# EAGLE design Active crossover V12 SMD (EAGLE 9.6.2)
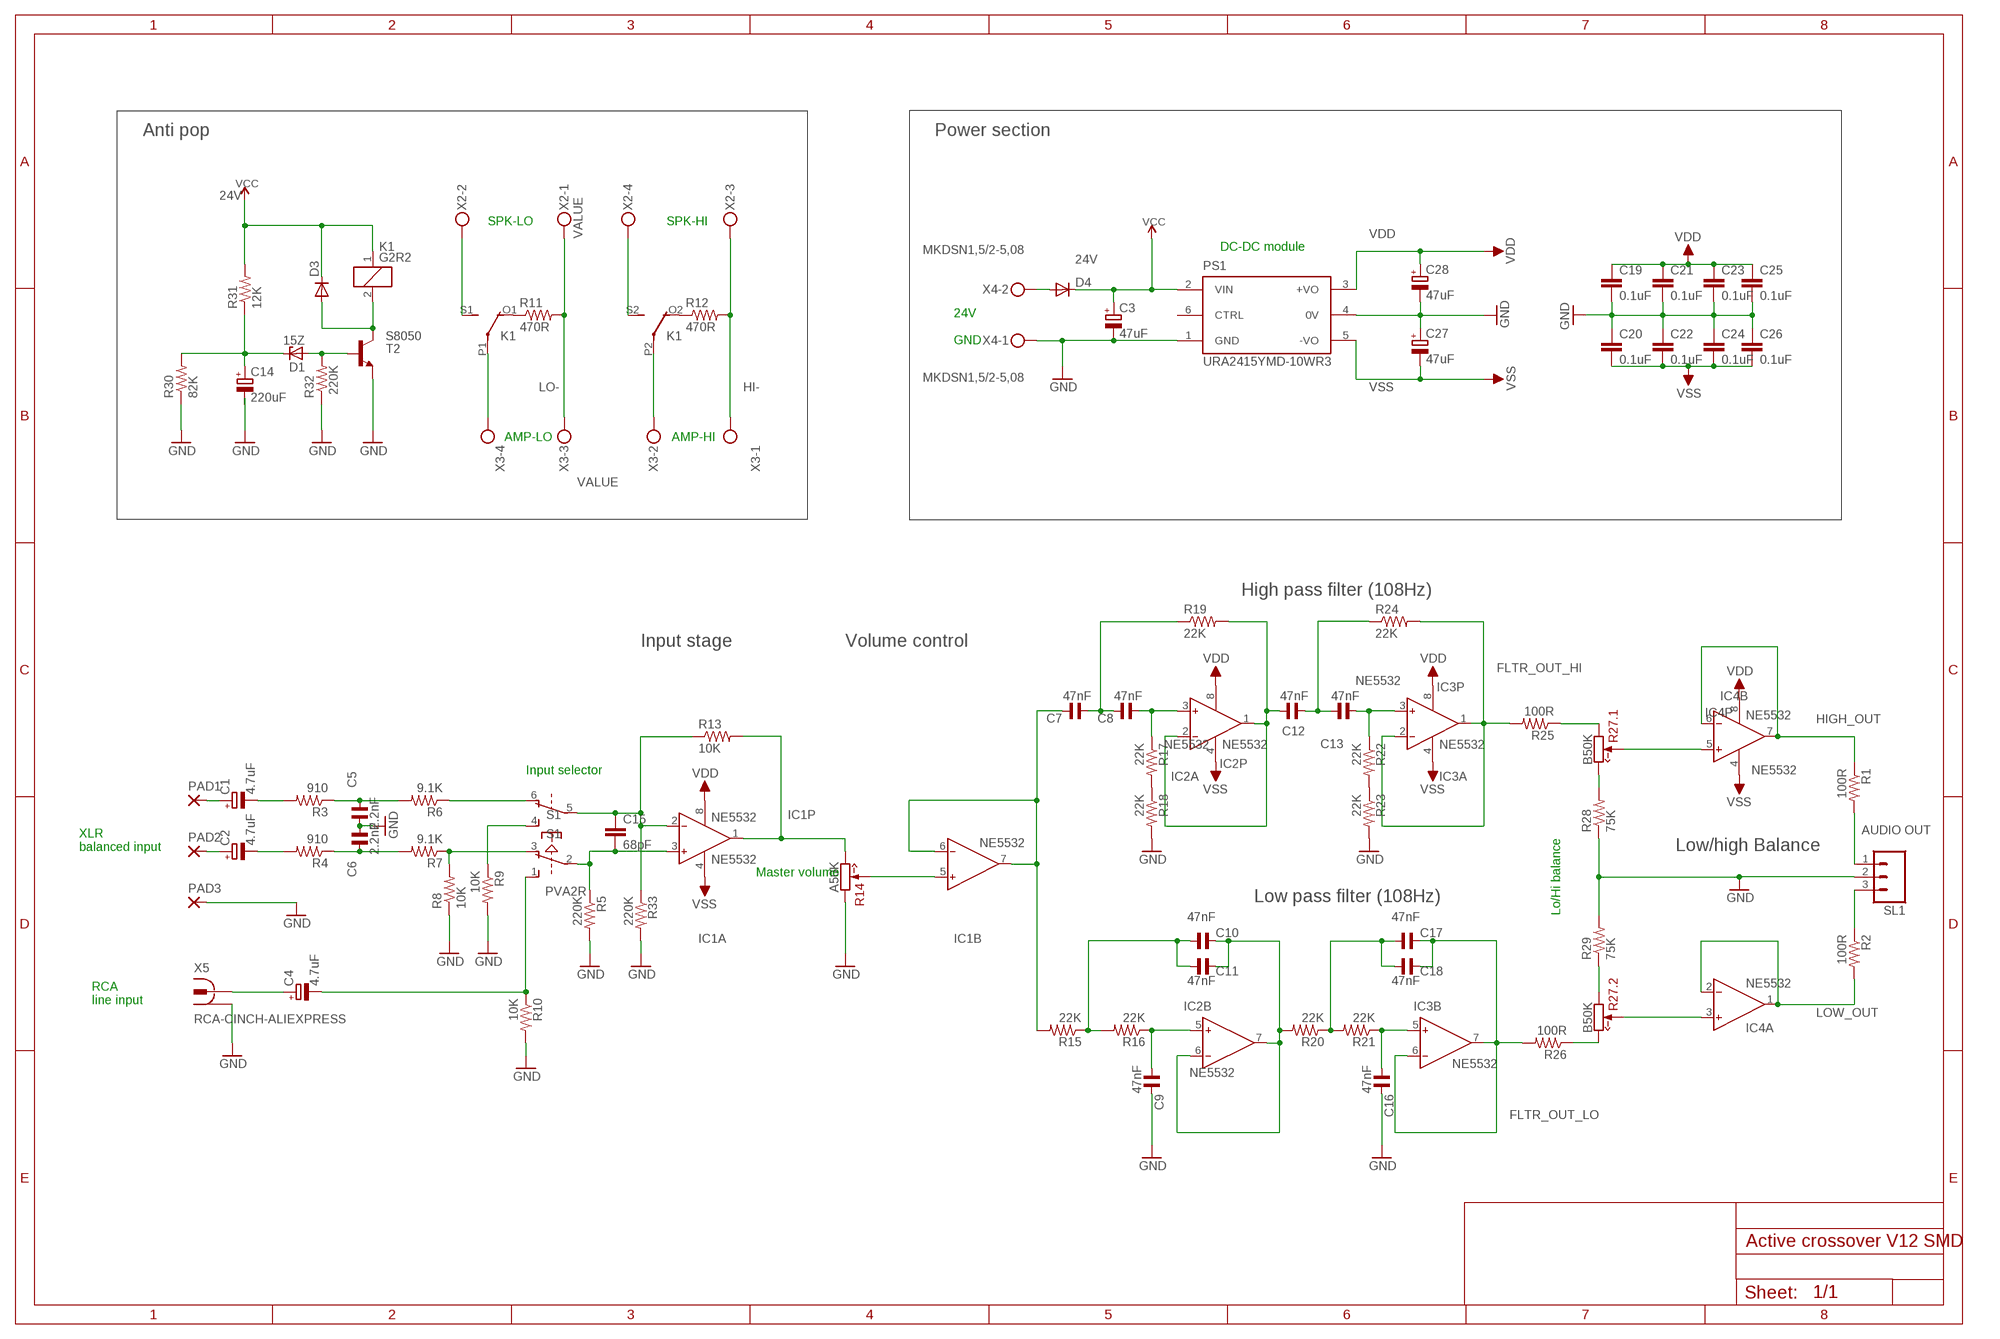
[diagram p0: schematic, sheet 1]

## Parts
C1  4.7uF  CPOL-EUE2-5  [E2-5]
C2  4.7uF  CPOL-EUE2-5  [E2-5]
C3  47uF  CPOL-EUE2.5-6  [E2,5-6]
C4  4.7uF  CPOL-EUE2-5  [E2-5]
C5  2.2nF  C_C050-025X072  [C050-025X072]
C6  2.2nF  C_C050-025X072  [C050-025X072]
C7  47nF  C_C050-025X072  [C050-025X072]
C8  47nF  C_C050-025X072  [C050-025X072]
C9  47nF  C_C050-025X072  [C050-025X072]
C10  47nF  C_C050-025X072  [C050-025X072]
C11  47nF  C_C050-025X072  [C050-025X072]
C12  47nF  C_C050-025X072  [C050-025X072]
C13  47nF  C_C050-025X072  [C050-025X072]
C14  220uF  CPOL-EUE3.5-8  [E3,5-8]
C15  68pF  0.1UF-25V-5%(0603)  [0603-CAP]
C16  47nF  C_C050-025X072  [C050-025X072]
C17  47nF  C_C050-025X072  [C050-025X072]
C18  47nF  C_C050-025X072  [C050-025X072]
C19  0.1uF  0.1UF-25V-5%(0603)  [0603-CAP]
C20  0.1uF  0.1UF-25V-5%(0603)  [0603-CAP]
C21  0.1uF  0.1UF-25V-5%(0603)  [0603-CAP]
C22  0.1uF  0.1UF-25V-5%(0603)  [0603-CAP]
C23  0.1uF  0.1UF-25V-5%(0603)  [0603-CAP]
C24  0.1uF  0.1UF-25V-5%(0603)  [0603-CAP]
C25  0.1uF  0.1UF-25V-5%(0603)  [0603-CAP]
C26  0.1uF  0.1UF-25V-5%(0603)  [0603-CAP]
C27  47uF  CPOL-EUE2.5-6  [E2,5-6]
C28  47uF  CPOL-EUE2.5-6  [E2,5-6]
D1  15Z  ZENER-DIODEZD-7.5  [ZDIO-7.5]
D3  DIODESMA-ALT  [SMA-DIODE_ALT]
D4  DIODESMB  [SMB-DIODE]
IC1  NE5532  AD712N  [DIL08]
IC2  NE5532  AD712N  [DIL08]
IC3  NE5532  AD712N  [DIL08]
IC4  NE5532  AD712N  [DIL08]
K1  G2R2  [G2R2]
PAD1  3,17/1,3  [3,17/1,3]
PAD2  3,17/1,3  [3,17/1,3]
PAD3  3,17/1,3  [3,17/1,3]
PS1  URA2415YMD-10WR3  URA2405YMD-10WR3  [CONV_URA2405YMD-10WR3]
R1  100R  R-US_0204/7  [0204/7]
R2  100R  R-US_0204/7  [0204/7]
R3  910  R-US_0204/7  [0204/7]
R4  910  R-US_0204/7  [0204/7]
R5  220K  R-US_0204/7  [0204/7]
R6  9.1K  R-US_0204/7  [0204/7]
R7  9.1K  R-US_0204/7  [0204/7]
R8  10K  R-US_0204/7  [0204/7]
R9  10K  R-US_0204/7  [0204/7]
R10  10K  R-US_0204/7  [0204/7]
R11  470R  R-US_0204/7  [0204/7]
R12  470R  R-US_0204/7  [0204/7]
R13  10K  R-US_0204/7  [0204/7]
R14  A50K  A10K(9MM)  [RV09-SINGLE]
R15  22K  R-US_0204/7  [0204/7]
R16  22K  R-US_0204/7  [0204/7]
R17  22K  R-US_0204/7  [0204/7]
R18  22K  R-US_0204/7  [0204/7]
R19  22K  R-US_0204/7  [0204/7]
R20  22K  R-US_0204/7  [0204/7]
R21  22K  R-US_0204/7  [0204/7]
R22  22K  R-US_0204/7  [0204/7]
R23  22K  R-US_0204/7  [0204/7]
R24  22K  R-US_0204/7  [0204/7]
R25  100R  R-US_0204/7  [0204/7]
R26  100R  R-US_0204/7  [0204/7]
R27  B50K  7PIN  [RK14-DUAL]
R28  75K  R-US_0204/7  [0204/7]
R29  75K  R-US_0204/7  [0204/7]
R30  82K  R-US_M0805  [M0805]
R31  12K  R-US_M0805  [M0805]
R32  220K  R-US_M0805  [M0805]
R33  220K  R-US_0204/7  [0204/7]
S1  PVA2R  [PVA2R]
SL1  AUDIO OUT  M03  [03P]
T2  S8050  BC846  [SOT23]
X2  MKDSN1,5/4-5,08  [MKDSN1,5/4-5,08]
X3  MKDSN1,5/4-5,08  [MKDSN1,5/4-5,08]
X4  MKDSN1,5/2-5,08  [MKDSN1,5/2-5,08]
X5  RCA-CINCH-ALIEXPRESS  [RCA-CINCH-ALIEXPRESS]

## Nets
24V: C3.+ D3.C D4.C K1.1 PS1.2(VIN) R31.2 ; supply symbol labelled VCC
FLTR_OUT_HI: IC3.1(A:OUT) IC3.2(A:IN-) R24.2 R25.2
FLTR_OUT_LO: C17.2 C18.2 IC3.6(B:IN-) IC3.7(B:OUT) R26.2
GND: C3.- C5.1 C6.2 C9.2 C14.- C16.2 C19.2 C20.1 C21.2 C22.1 C23.2 C24.1 C25.2 C26.1 C27.+ C28.- PAD3.1(P) PS1.1(GND) PS1.4(0V) R5.2 R8.1 R9.2 R10.2 R14.1(CCW) R18.2 R23.2 R28.1 R29.2 R30.1 R32.1 R33.2 SL1.2 T2.2(E) X4.1 X5.P$1 X5.P$3
HI-: R12.2 X2.3 X3.1
HIGH_OUT: IC4.6(B:IN-) IC4.7(B:OUT) R1.1
LO-: R11.2 X2.1 X3.3
LOW_OUT: IC4.1(A:OUT) IC4.2(A:IN-) R2.2
N$1: C1.+ PAD1.1(P)
N$2: C1.- R3.2
N$3: R7.1 R8.2 S1.3(1:O)
N$4: C15.1 IC1.2(A:IN-) R13.1 R33.1 S1.5(2:P)
N$5: C15.2 IC1.3(A:IN+) R5.1 S1.2(1:P)
N$6: C4.- R10.1 S1.1(1:S)
N$7: R6.1 S1.6(2:O)
N$8: R9.1 S1.4(2:S)
N$9: IC1.1(A:OUT) R13.2 R14.3(CW)
N$10: C14.+ D1.C R30.2 R31.1
N$11: K1.P1(2:P) X3.4
N$12: D1.A R32.2 T2.1(B)
N$13: D3.A K1.2 T2.3(C)
N$14: IC1.5(B:IN+) R14.2(W)
N$15: K1.S1(2:S) X2.2
N$16: C16.1 IC3.5(B:IN+) R21.1
N$17: C5.2 R3.1 R6.2
N$18: C6.1 R4.1 R7.2
N$19: C10.1 C11.1 R15.1 R16.2
N$20: C17.1 C18.1 R20.1 R21.2
N$21: C8.1 IC2.3(A:IN+) R17.1
N$22: C7.1 C8.2 R19.1
N$23: R27.3(.2:CCW) R29.1
N$24: C9.1 IC2.5(B:IN+) R16.1
N$25: R27.1'(.1:CW) R28.2
N$26: C12.2 IC2.1(A:OUT) IC2.2(A:IN-) R19.2
N$27: C12.1 C13.2 R24.1
N$28: C13.1 IC3.3(A:IN+) R22.1
N$29: C10.2 C11.2 IC2.6(B:IN-) IC2.7(B:OUT) R20.2
N$30: K1.O1(2:O) R11.1
N$31: K1.P2(3:P) X3.2
N$32: K1.S2(3:S) X2.4
N$33: K1.O2(3:O) R12.1
N$34: R17.2 R18.1
N$35: C7.2 IC1.6(B:IN-) IC1.7(B:OUT) R15.2
N$36: R22.2 R23.1
N$37: R25.1 R27.3'(.1:CCW)
N$38: IC4.5(B:IN+) R27.2'(.1:W)
N$39: IC4.3(A:IN+) R27.2(.2:W)
N$40: R26.1 R27.1(.2:CW)
N$42: C2.+ PAD2.1(P)
N$43: C2.- R4.2
N$44: C4.+ X5.P$2
N$45: D4.A X4.2
N$46: R1.2 SL1.1
N$47: R2.1 SL1.3
VDD: C19.1 C21.1 C23.1 C25.1 C28.+ IC1.8(P:V+) IC2.8(P:V+) IC3.8(P:V+) IC4.8(P:V+) PS1.3(+VO)
VSS: C20.2 C22.2 C24.2 C26.2 C27.- IC1.4(P:V-) IC2.4(P:V-) IC3.4(P:V-) IC4.4(P:V-) PS1.5(-VO)
Unconnected: PS1.6(CTRL)

## Notes on the sheet
- Anti pop | Power section
- SPK-LO | SPK-HI
- DC-DC module
- 24V
  
  GND
- AMP-LO | AMP-HI
- High pass filter (108Hz)
- Input stage | Volume control
- Input selector
- XLR 
  balanced input
- Low/high Balance
- Master volume
- Low pass filter (108Hz)
- Lo/Hi balance
- RCA 
  line input

## Library data of the parts
C1-C4 C14 C27 C28 = rcl:CPOL-EU: POLARIZED CAPACITOR, European symbol; SPICEPREFIX: C
C5-C13 C16-C18 = cap-wima:C_: NON-POLARIZED CAP
C15 = SparkFun-Capacitors:0.1UF-25V-5%(0603): CAP-08604; PROD_ID: CAP-08604; VALUE: 0.1uF
C19-C26 = SparkFun-Capacitors:0.1UF-25V-5%(0603): CAP-08604; PROD_ID: CAP-08604
D1 = diode:ZENER-DIODE: Z-Diode
D3 D4 = SparkFun-DiscreteSemi:DIODE: Diode These are standard reverse protection diodes and small signal diodes. SMA package can handle up to about 1A. SOD-323 can handle about 200mA. What the SOD-323 package when ordering, there are some mfgs out there that are 5-pin packages.
IC1-IC4 = analog-devices:AD712: Dual Precision, Low Cost, High Speed BiFET Op Amp Source: http://www.analog.com/static/imported-files/data_sheets/AD712.pdf; MF: ALTERA CORPORATION; MPN: AD712JNZ; OC_FARNELL: 9604898; OC_NEWARK: 59K4554
K1 = relay:G2R2: RELAY 2 x switch, Omron; MANUFACTURER: OMRON COMPONENTS USA; MPN: G2R-2-DC6
PAD1-PAD3 = wirepad:3,17/1,3: THROUGH-HOLE PAD
PS1 = URA2405YMD-10WR3:URA2405YMD-10WR3: DC/DC Converter; MANUFACTURER: Mornsun; MAXIMUM_PACKAGE_HEIGHT: 12.20 mm; PARTREV: 2019.11.13-A/9; STANDARD: Manufacturer Recommendations
R1-R13 R15-R26 R28-R33 = adafruit:R-US_: RESISTOR, American symbol
R14 = potentiometers:?; MOUSER: 652-PTV09A4025FA103
R27 = potentiometers:7PIN
S1 = switch-misc:PVA2R: ITT SWITCH
SL1 = con-amp-quick:M03: AMP QUICK CONNECTOR; OC_FARNELL: unknown; OC_NEWARK: unknown
T2 = transistor:BC846: NPN TRANSISTOR
X2 X3 = con-phoenix-508:MKDSN1,5/4-5,08: MKDSN 1,5/ 4-5,08 Printklemme Nennstrom: 13,5 A Nennspannung: 250 V Rastermaß: 5,08 mm Polzahl: 4 Anschlussart: Schraubanschluss Montage: Löten Anschlussrichtung Leiter/Platine: 0 ° Artikelnummer: 1729144 Source: http://eshop.phoenixcontact.com .. 1729144.pdf
X4 = con-phoenix-508:MKDSN1,5/2-5,08: MKDSN 1,5/ 2-5,08 Printklemme Nennstrom: 13,5 A Nennspannung: 250 V Rastermaß: 5,08 mm Polzahl: 2 Anschlussart: Schraubanschluss Montage: Löten Anschlussrichtung Leiter/Platine: 0 ° Artikelnummer: 1729128 Source: http://eshop.phoenixcontact.com .. 1729128.pdf
X5 = con-conrad:RCA-CINCH-ALIEXPRESS: Cinch Connector ( RCA Jack ) Cinch-Einbaukupplung 90º 72345 Vernickelt BKL Electronic Source: Conrad <http://www.conrad.de/ce/de/product/736880>

## Board
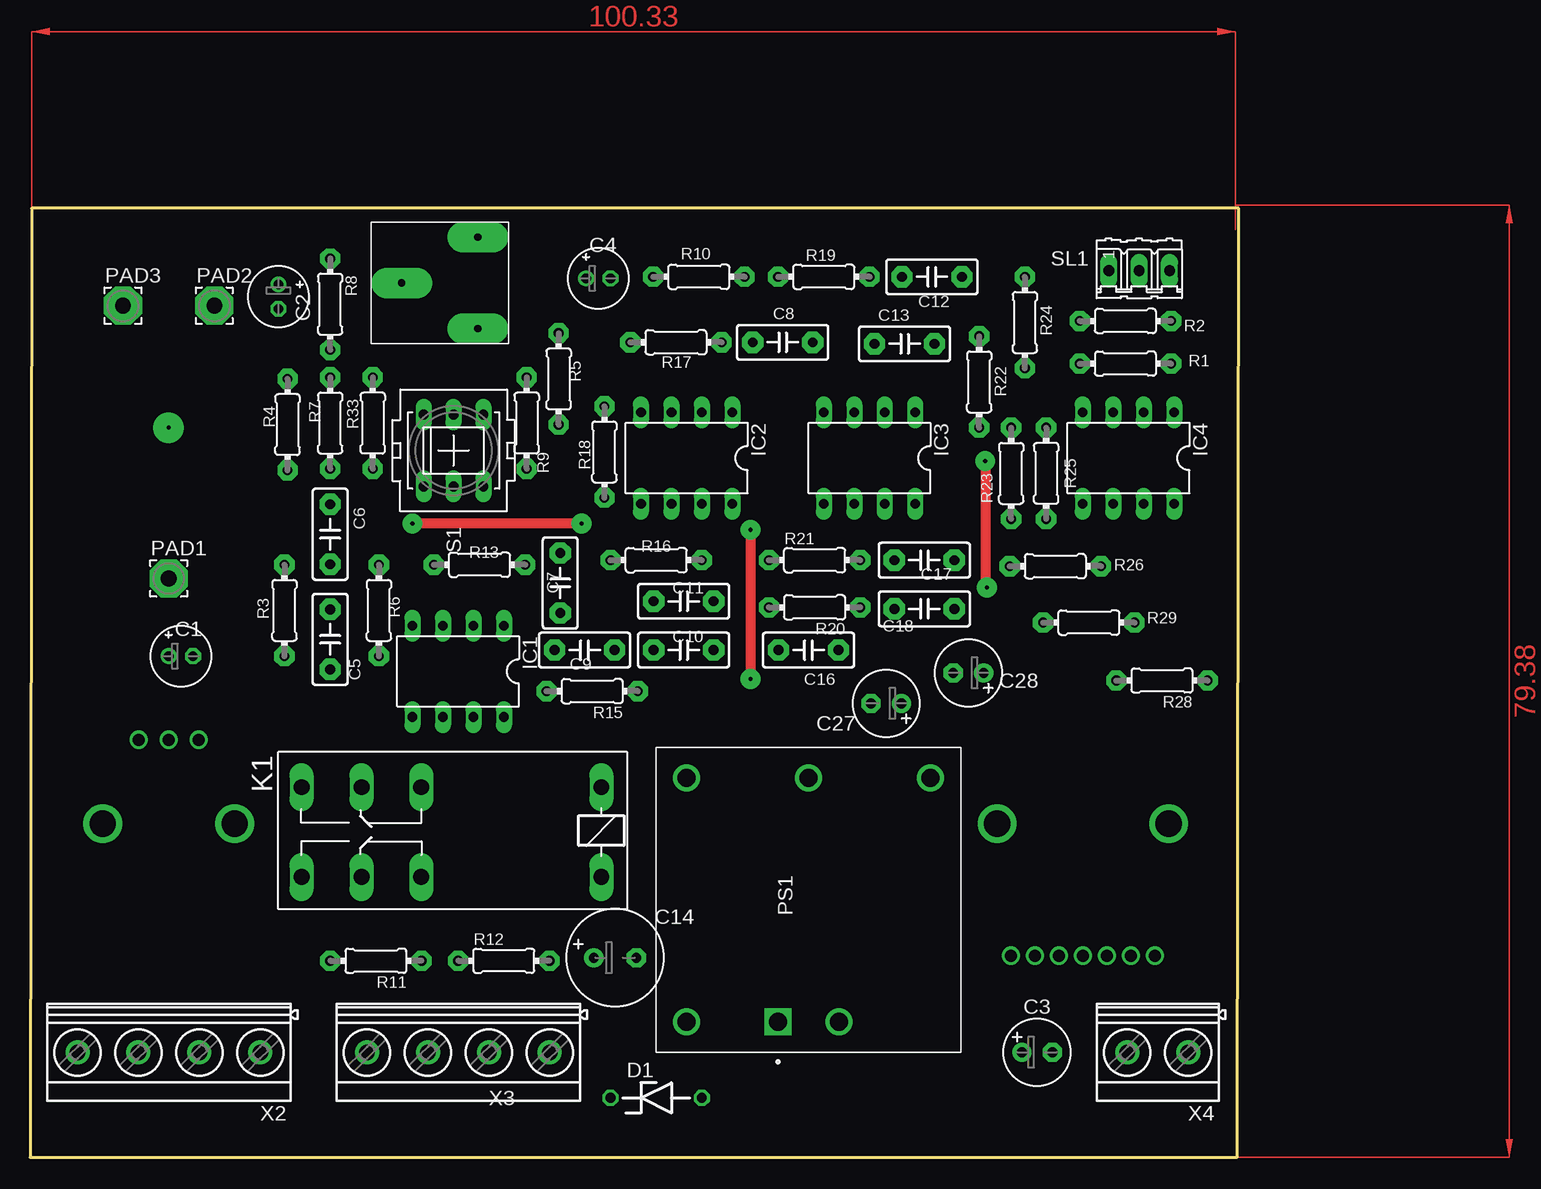
[diagram p1: board, top side]
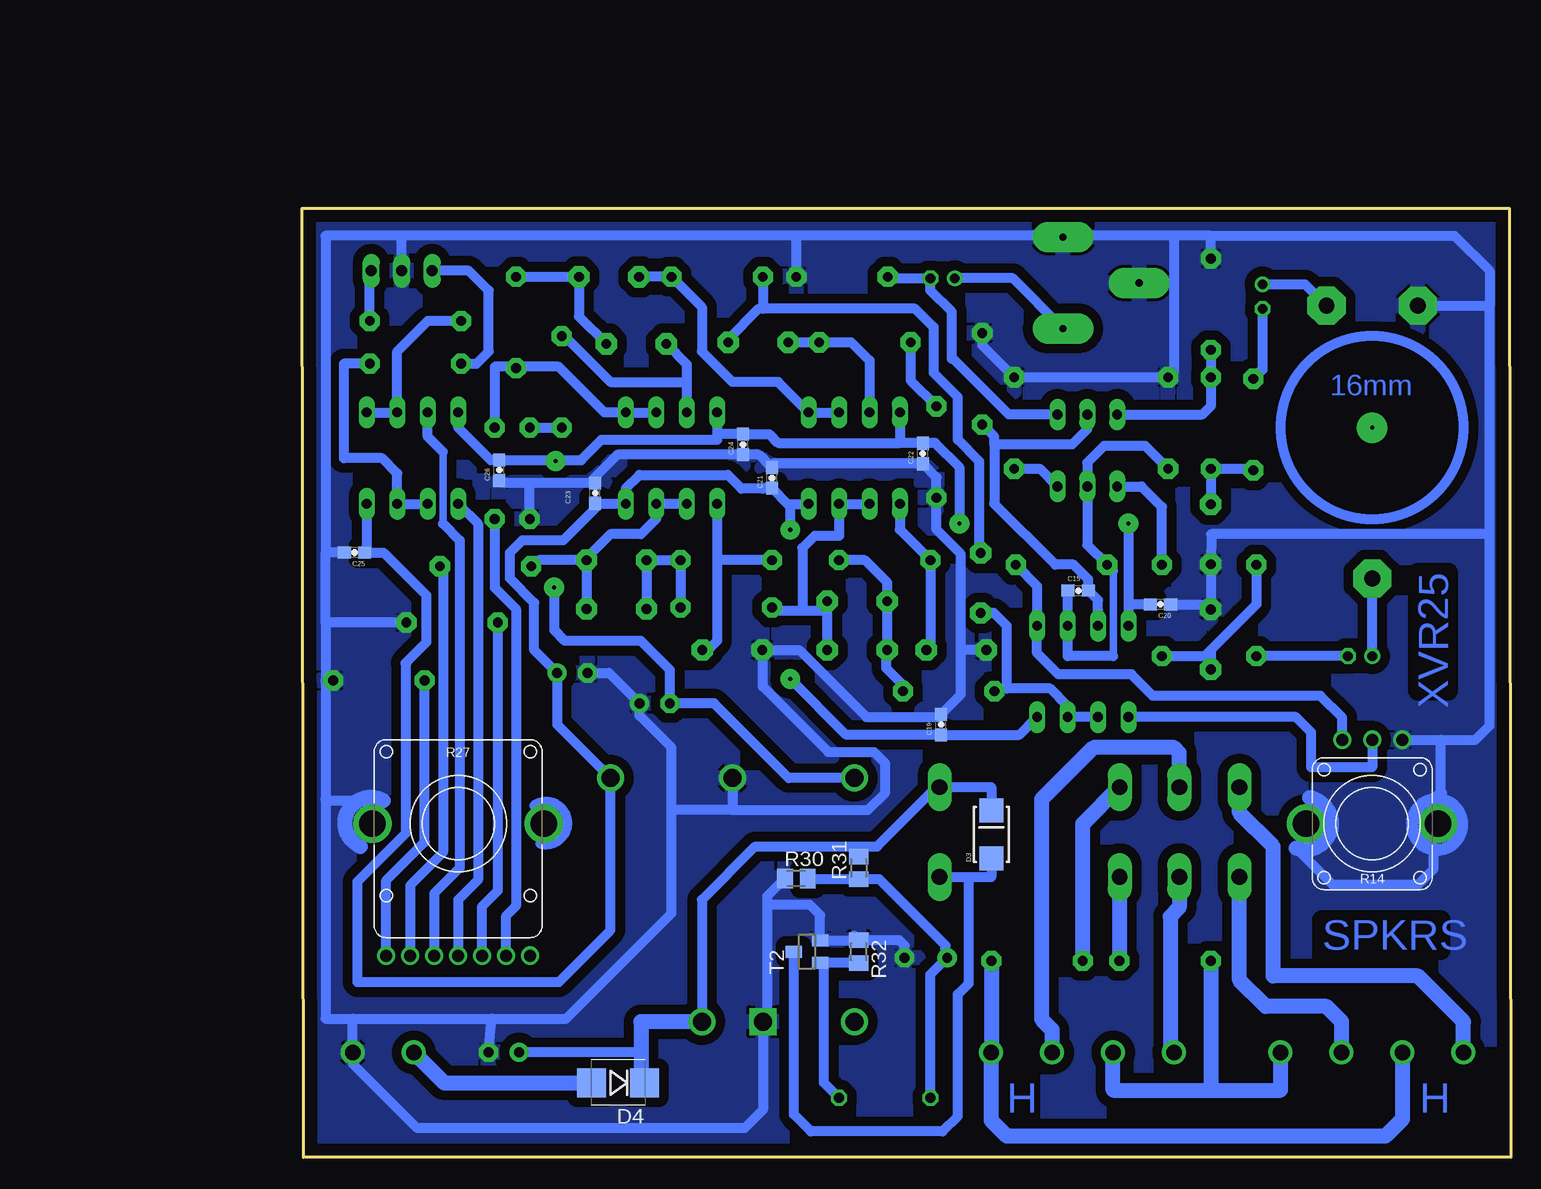
[diagram p2: board, bottom side, seen from below]

Size 100.76 x 79.11 mm. Coordinates in mm from the lower left corner, seen from the top.
Outline: 0,0 100.63,0 100.76,79.11 0.13,79.11 0,0
Copper layers (1*16): Top 0.035mm / dielectric 1.5mm / Bottom 0.035mm
Design rules "default": minimum track width 6mil, minimum drill 0.35mm, track to track 6mil, track to pad 6mil, pad to pad 6mil, via to via 6mil, smd to smd 6mil, copper to edge 40mil, drill to drill 6mil, minimum pad ring 10mil, minimum via ring 8mil, stop-mask expansion 4mil, vias tented up to drill 0mil, thermal gap 10mil

### Footprints (pad centres in the part's own frame; a part is rotated, then mirrored left to right if it is on the bottom)
E2-5 = drill 0.813 pad 1.27: + -1.016,0 | drill 0.813 pad 1.27 octagon: - 1.016,0
E2,5-6 = drill 0.813 pad 1.6: + -1.27,0 | drill 0.813 pad 1.6 octagon: - 1.27,0
C050-025X072 = drill 0.813 pad 1.778 octagon: 1 -2.5,0; 2 2.5,0
E3,5-8 = drill 0.813 pad 1.6: + -1.778,0 | drill 0.813 pad 1.6 octagon: - 1.778,0
0603-CAP = smd 1.1 x 1: 1 -0.85,0; 2 0.85,0
ZDIO-7.5 = drill 0.813 octagon: A 3.81,0; C -3.81,0
SMA-DIODE_ALT = smd 2 x 2: A -2,0; C 2,0
SMB-DIODE = smd 2.4 x 2.4: A 2.2,0; C -2.2,0
DIL08 = drill 0.813 long: 1 -3.81,-3.81; 2 -1.27,-3.81; 3 1.27,-3.81; 4 3.81,-3.81; 5 3.81,3.81; 6 1.27,3.81; 7 -1.27,3.81; 8 -3.81,3.81
G2R2 = drill 1.321 long: 1 -2.54,-3.683; 2 -2.54,3.81; O1 12.471,3.81; O2 12.471,-3.683; P1 17.45,3.81; P2 17.45,-3.683; S1 22.454,3.81; S2 22.454,-3.683
3,17/1,3 = drill 1.321 pad 3.175 octagon: 1 0,0
CONV_URA2405YMD-10WR3 = drill 1.5 square: 1 -10.16,2.54 | drill 1.5: 2 -10.16,-2.54; 3 10.16,-10.16; 4 10.16,0; 5 10.16,10.16; 6 -10.16,10.16
0204/7 = drill 0.813 pad 1.676 octagon: 1 -3.81,0; 2 3.81,0
RV09-SINGLE = drill 1: 1 -2.5,-7; 2 0,-7; 3 2.5,-7 | drill 2.2: S1 -5.5,0; S2 5.5,0
RK14-DUAL = drill 1: 1 -4,-11; 1' -6,-11; 2 -2,-11; 2' 0,-11; 3 2,-11; 3' 4,-11; 4 6,-11 | drill 2.2: S1 -7.15,0; S2 7.15,0
M0805 = smd 1.3 x 1.6: 1 -0.95,0; 2 0.95,0
PVA2R = drill 0.813 long: 1 -2.997,2.489; 2 -2.997,0; 3 -2.997,-2.489; 4 2.997,2.489; 5 2.997,0; 6 2.997,-2.489
03P = drill 0.914 long: 1 -2.54,0; 2 0,0; 3 2.54,0
SOT23 = smd 1 x 1.4: 1 -0.95,-1.1; 2 0.95,-1.1; 3 0,1.1
MKDSN1,5/4-5,08 = drill 1.3 pad 2: 1 -7.641,0.025; 2 -2.561,0.025; 3 2.519,0.025; 4 7.599,0.025
MKDSN1,5/2-5,08 = drill 1.3 pad 2: 1 -2.561,0.025; 2 2.519,0.025
RCA-CINCH-ALIEXPRESS = drill 0.6 pad 2.54 long: P$1 -3.81,0; P$2 3.81,0; P$3 0,-6.35

### Placement (x,y rotation side)
C1  12.57,41.78 0 top
C2  20.7,71.76 270 top
C3  83.95,8.76 0 top
C4  47.37,73.28 0 top
C5  25.02,43.18 270 top
C6  25.02,51.94 270 top
C7  44.2,47.88 270 top
C8  62.74,67.95 0 top
C9  46.23,42.29 180 top
C10  54.48,42.29 0 top
C11  54.48,46.35 0 top
C12  75.18,73.41 180 top
C13  72.9,67.82 0 top
C14  48.77,16.64 0 top
C15  36.07,47.24 0 bottom
C16  64.9,42.29 180 top
C17  74.55,49.78 0 top
C18  74.55,45.72 0 top
C19  47.5,36.07 90 bottom
C20  29.21,46.1 180 bottom
C21  61.6,56.64 90 bottom
C22  49.02,58.67 90 bottom
C23  76.33,55.37 90 bottom
C24  64.01,59.44 90 bottom
C25  96.39,50.42 180 bottom
C26  84.33,57.28 90 bottom
C27  71.37,37.85 180 top
C28  78.23,40.39 180 top
D1  52.2,4.95 0 top
D3  43.31,26.92 90 bottom
D4  74.42,6.22 180 bottom
IC1  35.69,40.51 180 top
IC2  54.74,58.29 180 top
IC3  69.98,58.29 180 top
IC4  91.57,58.29 180 top
K1  45.09,27.18 180 top
PAD1  11.56,48.26 0 top
PAD2  15.37,70.99 0 top
PAD3  7.75,70.99 0 top
PS1  64.9,21.46 90 top
R1  91.31,66.17 180 top
R2  91.31,69.72 180 top
R3  21.21,45.59 270 top
R4  21.46,61.09 90 top
R5  44.07,64.9 90 top
R6  29.08,45.59 270 top
R7  25.02,61.21 270 top
R8  25.02,71.12 270 top
R9  41.4,61.21 90 top
R10  55.75,73.41 0 top
R11  28.83,16.38 180 top
R12  39.5,16.38 0 top
R13  37.47,49.4 0 top
R14  11.56,27.81 180 bottom
R15  46.86,38.86 180 top
R16  52.2,49.78 0 top
R17  53.85,67.95 180 top
R18  47.88,58.8 270 top
R19  66.17,73.41 0 top
R20  65.41,45.85 180 top
R21  65.41,49.78 0 top
R22  79.12,64.64 270 top
R23  81.79,57.02 270 top
R24  82.93,69.6 270 top
R25  84.71,57.02 90 top
R26  85.47,49.28 180 top
R27  87.76,27.81 0 bottom
R28  94.36,39.75 180 top
R29  88.27,44.58 0 top
R30  59.56,23.24 0 bottom
R31  54.36,24.13 90 bottom
R32  54.36,17.14 270 bottom
R33  28.57,61.21 90 top
S1  35.31,58.93 270 top
SL1  92.46,73.91 0 top
T2  58.67,17.14 90 bottom
X2  11.56,8.76 180 top
X3  35.69,8.76 180 top
X4  93.98,8.76 180 top
X5  37.34,72.9 270 top

### Tracks (layer width: path | path; a pad name or v marks a point on that pad's centre or on a via)
24V
  Bottom 0.813: PS1.2 67.44,21.46 62.99,25.91 54.36,25.91 | D3.C 43.31,30.86 K1.1 47.88,30.86 52.83,25.91 54.36,25.91 | R31.2 54.36,25.91 | 72.52,8.76 C3.+
  Bottom 1.27: PS1.2 72.52,11.3 72.52,8.76 72.52,6.52 D4.C
FLTR_OUT_HI
  Bottom 0.813: IC3.2 IC3.1 75.56,62.1 79.38,65.91 83.1,65.91 | R24.2 83.1,65.91 | R25.2 84.71,65.91 83.1,65.91
FLTR_OUT_LO
  Bottom 0.813: IC3.6 IC3.7 71.25,53.21 72.52,51.94 75.06,51.94 77.05,49.95 C17.2 | C17.2 C18.2 | R26.2 81.53,49.28 81.03,49.78 C17.2
GND
  Bottom 0.813: 1.78,51.94 1.78,36 2.96,34.81 5.84,34.81 | PAD3.1 1.78,70.99 | 1.78,70.99 1.78,73.91 4.7,76.84 25.02,76.84 | 1.78,51.94 1.78,70.99 | R14.1 5.84,34.81 | 98.81,50.29 98.81,76.84 92.46,76.84 | 1.78,51.94 24.98,51.94 C6.2 C5.1 25.46,46.1 C20.1 | 96.54,11.56 X4.1 96.54,7.79 91.17,2.43 63.88,2.43 62.36,3.95 PS1.1 61.98,11.68 61.98,21.08 | C16.2 62.36,42.29 | 62.36,42.29 59.31,42.29 53.72,36.7 47.71,36.7 C19.2 | 69.98,28.96 69.98,20.32 78.74,11.56 84.96,11.56 | 96.54,11.56 84.96,11.56 | 98.81,44.58 98.81,39.75 | 98.81,39.75 98.81,29.85 | 98.81,29.85 98.81,11.56 96.54,11.56 | C25.2 98.68,50.42 98.81,50.29 | 98.81,44.58 98.81,50.29 | R29.2 98.81,44.58 | 98.3,39.75 R28.1 98.81,39.75 | C28.- 75.18,40.39 C27.+ 72.64,36.83 69.98,34.16 69.98,28.96 | 64.9,28.96 69.98,28.96 | 64.9,28.96 53.59,28.96 52.2,30.35 52.2,32.89 53.09,33.78 56.9,33.78 62.36,39.24 62.36,42.29 | C19.2 47.37,37.04 | R32.1 T2.2 57.57,20.19 58.46,21.08 61.98,21.08 | R32.1 54.74,18.48 | C14.- 50.55,17.65 50.99,18.1 R32.1 | PS1.4 64.9,28.96 | 61.98,21.08 61.98,21.78 R30.1 | 25.02,76.84 28.07,76.84 | 59.56,76.84 92.46,76.84 | R8.1 25.02,76.84 | C3.- 84.96,11.56 | R10.2 59.56,76.84 | 81.79,56.22 C23.2 76.33,56.73 74.47,58.59 C24.1 62.69,58.59 61.74,57.64 | 81.79,56.22 84.12,56.22 C26.1 | R23.2 81.79,56.22 | 61.74,57.64 C21.2 | 61.74,57.64 61.56,57.82 C22.1 47.88,56.68 R18.2 47.88,52.32 45.85,50.29 45.85,42.29 | 28.07,72.9 28.07,76.84 | C19.2 45.85,38.57 45.85,42.29 | C9.2 45.85,42.29 | SL1.2 92.46,76.84 | 28.07,76.84 37.34,76.84 | 37.34,76.84 59.56,76.84 | X5.P$1 37.34,76.84 | X5.P$3 28.07,72.9 | R5.2 44.07,67.69 R9.2 R33.2 28.07,65.53 28.07,72.9 | 17.91,25.78 14.86,22.73 7.75,22.73 6.48,24 6.48,25.78
  Bottom 0.813: 5.84,30.35 5.84,34.81 | 93.98,29.72 98.68,29.72 98.81,29.85
  Bottom 1.016: 6.48,25.78 8.26,27.56 arc-350 8.26,27.94 5.84,30.35
  Bottom 1.27: 95.88,25.91 arc188 93.98,29.72 | 16.76,29.97 arc191 17.91,25.78
  pour Bottom (isolate 0.813): 0.13,0 0.13,79.38 101.73,79.38 101.73,0
HI-
  Bottom 0.152: X3.1 43.31,8.76
  Bottom 1.27: R12.2 43.31,8.76 | X2.3 9.04,3.17 10.44,1.78 42.04,1.78 43.33,3.07 X3.1
HIGH_OUT
  Bottom 0.813: IC4.6 IC4.7 92.84,57.02 94.11,58.29 97.28,58.29 97.28,66.17 R1.1
LO-
  Bottom 1.27: X3.3 33.17,5.59 25.02,5.59 | R11.2 25.02,5.59 | 25.02,5.59 19.18,5.59 19.2,5.61 X2.1
LOW_OUT
  Bottom 0.813: IC4.1 IC4.2 92.84,67.18 90.3,69.72 R2.2
N$1
  Bottom 0.813: C1.+ PAD1.1
N$2
  Bottom 0.813: C1.- R3.2
N$3
  Bottom 0.813: R8.2 R7.1 25.02,62.61 25.7,61.92 S1.3
N$4
  Bottom 0.61: 33.15,41.78 33.15,48.89
  Bottom 0.813: 33.15,41.78 36.96,41.78 IC1.2 36.92,44.36 C15.1 | 33.15,48.89 R13.1 35.31,51.05 S1.5 35.31,57.91 33.91,59.31 30.48,59.31 R33.1
N$5
  Bottom 0.813: 34.42,45.59 IC1.3 34.42,46.44 C15.2 35.22,48.17 36.45,49.4 37.97,49.4 43.05,54.48 43.05,59.44 | S1.2 35.31,60.71 36.58,59.44 43.05,59.44 | 43.05,59.44 43.05,60.07 R5.1
N$6
  Bottom 0.813: R10.1 51.82,73.28 C4.- 48.39,72.26 46.61,70.48 46.61,66.55 46.48,66.55 41.86,61.92 S1.1
N$7
  Bottom 0.813: S1.6 30.79,55.93 29.08,54.23 R6.1
N$8
  Bottom 0.813: S1.4 39.27,57.4 R9.1
N$9
  Bottom 0.813: R13.2 39.5,47.62 IC1.1 39.5,42.04 37.72,40.26 31.62,40.26 29.84,38.48 15.88,38.48 14.06,36.66 R14.3
N$10
  Bottom 0.813: D1.C 48.39,15.24 C14.+ 47.12,16.76 47.12,17.65 52.64,23.18 R31.1 58.55,23.18 R30.2
N$11
  Bottom 1.27: K1.P1 27.63,20.83 28.4,20.07 28.4,9.05 X3.4
N$12
  Bottom 0.813: R32.2 57.28,16.2 | 57.28,16.2 T2.1 | D1.A 57.28,6.22 57.28,16.2
N$13
  Bottom 0.813: D3.A 43.31,23.37 45.21,23.37 | K1.2 45.21,23.37 | 45.21,23.37 45.21,14.48 46.1,13.59 46.1,3.43 47.37,2.16 58.35,2.16 59.77,3.59 T2.3 59.82,17.1
N$14
  Bottom 0.813: IC1.5 17.91,36.7 16.64,35.43 16.64,32.51 11.56,32.51 R14.2
N$15
  Bottom 1.27: X2.2 14.1,8.76 14.1,11.3 15.37,12.57 20.45,12.57 22.63,14.76 K1.S1
N$16
  Bottom 0.813: IC3.5 66.17,50.04 | 66.17,50.04 66.17,43.05 66.93,42.29 C16.1 | R21.1 65.91,49.78 66.17,50.04
N$17
  Bottom 0.813: R3.1 21.21,46.1 25.02,42.29 | 25.02,42.29 25.53,41.78 R6.2 | 25.02,42.29 C5.2
N$18
  Bottom 0.813: R4.1 21.59,57.4 R7.2 C6.1
N$19
  Bottom 0.813: R16.2 53.85,49.78 51.98,47.92 C11.1 C10.1 52.07,42.2 52.07,40.77 50.67,39.37 R15.1
N$20
  Bottom 0.813: R20.1 R21.2 C17.1 C18.1
N$21
  Bottom 0.813: IC2.3 53.47,66.42 54.99,67.95 R17.1 C8.1
N$22
  Bottom 0.813: 62.36,70.74 49.66,70.74 48.13,69.22 48.13,65.41 46.1,63.37 46.1,59.82 44.32,58.04 44.32,50.51 C7.1 | R19.1 62.36,70.74 | 62.36,70.74 62.7,70.74 65.24,68.2 C8.2
N$23
  Bottom 0.813: R27.3 85.76,20.92 84.45,22.23 R29.1
N$24
  Bottom 0.813: IC2.5 50.93,52.32 R16.1 48.39,42.63 C9.1
N$25
  Bottom 0.813: R27.1' 93.76,23.08 90.55,26.29 R28.2
N$26
  Bottom 0.813: IC2.2 IC2.1 61.09,64.64 64.9,64.64 67.44,67.18 67.44,70.87 R19.2 C12.2
N$27
  Bottom 0.813: R24.1 C12.1 77.68,70.1 C13.2
N$28
  Bottom 0.813: R22.1 78.87,68.45 75.06,64.64 68.71,64.64 | 68.71,64.64 IC3.3 | C13.1 68.71,66.13 68.71,64.64
N$29
  Bottom 0.813: IC2.6 IC2.7 56.01,51.82 58.04,51.82 59.05,50.8 59.05,45.59 | C10.2 56.98,45.59 | 56.98,45.59 C11.2 | R20.2 61.34,45.59 59.05,45.59 | 59.05,45.59 56.98,45.59
N$30
  Bottom 0.152: K1.O1 32.64,23.34
  Bottom 1.27: 32.64,23.34 R11.1
N$31
  Bottom 1.27: K1.P2 27.63,33.73 28.07,34.16 34.8,34.16 39.12,29.85 39.12,11.51 38.25,10.64 X3.2
N$32
  Bottom 1.27: X2.4 3.96,11.28 3.94,11.3 7.75,15.11 19.81,15.11 19.81,25.91 22.63,28.73 K1.S2
N$33
  Bottom 0.152: 32.64,30.86 K1.O2
  Bottom 1.27: R12.1 35.69,27.81 32.64,30.86
N$34
  Bottom 0.813: R17.2 50.04,64.77 R18.1
N$35
  Bottom 0.813: IC1.6 IC1.7 36.96,37.62 38.4,39.07 42.04,39.07 | C7.2 43.09,45.38 42.04,44.32 42.04,39.07 | 42.04,39.07 42.85,39.07 R15.2
N$36
  Bottom 0.813: R23.1 R22.2
N$37
  Bottom 0.813: R25.1 84.71,47.5 82.93,45.72 82.93,20.96 83.76,20.13 R27.3'
N$38
  Bottom 0.813: IC4.5 86.11,52.83 86.11,23.11 87.76,21.46 R27.2'
N$39
  Bottom 0.61: 89.03,58.8 89.03,52.83
  Bottom 0.813: 89.03,58.8 90.3,60.07 IC4.3 | R27.2 89.76,22 87.63,24.13 87.63,51.43 89.03,52.83
N$40
  Bottom 0.813: R26.1 89.03,49.02 89.03,25.4 91.76,22.67 R27.1
N$41  (via drill 0.35 pad 2.54)
  other vias: 11.56,60.83
N$42
  Bottom 0.813: PAD2.1 17.14,72.77 C2.+
N$43
  Bottom 0.813: C2.- 20.7,65.66 R4.2
N$44
  Bottom 0.813: X5.P$2 41.53,73.28 C4.+
N$45
  Bottom 1.27: X4.2 88.92,6.2 76.65,6.2 D4.A
N$46
  Bottom 0.813: R1.2 86.23,66.17 85.22,67.18 85.22,72.26 86.87,73.91 SL1.1
N$47
  Bottom 0.813: R2.1 95.12,73.79 SL1.3
N$50
  Bottom 0.813: 80.9,26.16 arc-229 81.41,29.34
VDD  (via drill 0.35 pad 1.65)
  Top 0.813: v60.07,52.32 v60.07,39.88
  Bottom 0.813: C25.1 95.29,50.42 | IC1.8 40.98,35.22 C19.1 55.41,35.22 v60.07,39.88 | IC4.8 95.38,50.42 C25.1 | C25.1 93.98,50.42 90.42,46.86 90.42,42.93 92.14,41.21 92.07,41.15 92.07,27.05 96.14,22.99 96.14,14.6 79.38,14.6 75.06,18.92 PS1.3 79.5,36.07 C28.+ 81.41,42.29 81.41,46.23 83.44,48.26 83.44,50.42 82.42,51.43 78.99,51.43 76.33,54.1 C23.1 73.83,54.52 IC3.8 73.79,55.75 72.64,56.9 65.28,56.9 64.13,55.75 62.36,55.75 62.32,55.79 C21.1 60.29,54.48 | 60.29,54.48 IC2.8 | v60.07,52.32 60.07,54.27 60.29,54.48
VSS  (via drill 0.35 pad 1.65)
  Top 0.813: v79.63,58.04 79.63,47.62 v79.76,47.5 | v45.97,52.83 v31.88,52.83
  Bottom 0.813: IC2.4 50.93,59.56 | 49.02,59.56 48.01,59.56 45.97,57.53 v45.97,52.83 | 49.02,59.56 50.93,59.56 | 49.02,59.56 C22.2 49.19,59.69 | IC3.4 66.17,60.2 | 66.17,60.2 66.17,59.82 75.82,59.82 77.51,58.13 79.63,58.13 | IC4.4 87.76,60.83 85.05,58.13 C26.2 79.63,58.13 | v31.88,52.83 31.88,46.1 | 31.88,46.1 IC1.4 | C20.2 31.88,46.1 | PS1.5 60.2,31.62 66.42,37.85 C27.- 70.1,40.64 72.52,43.05 78.87,43.05 79.76,43.94 v79.76,47.5 | v79.63,58.04 79.63,58.13 | 50.93,59.56 61.09,59.56 61.81,60.29 C24.2 66.08,60.29 66.17,60.2
(copper drawn outside any net)
  shapes: Bottom circle x1, Top area x2

### Text on the board
Bottom: 16mm | XVR25 | SPKRS | H | H